# EAGLE design sym (EAGLE 6.6.0)
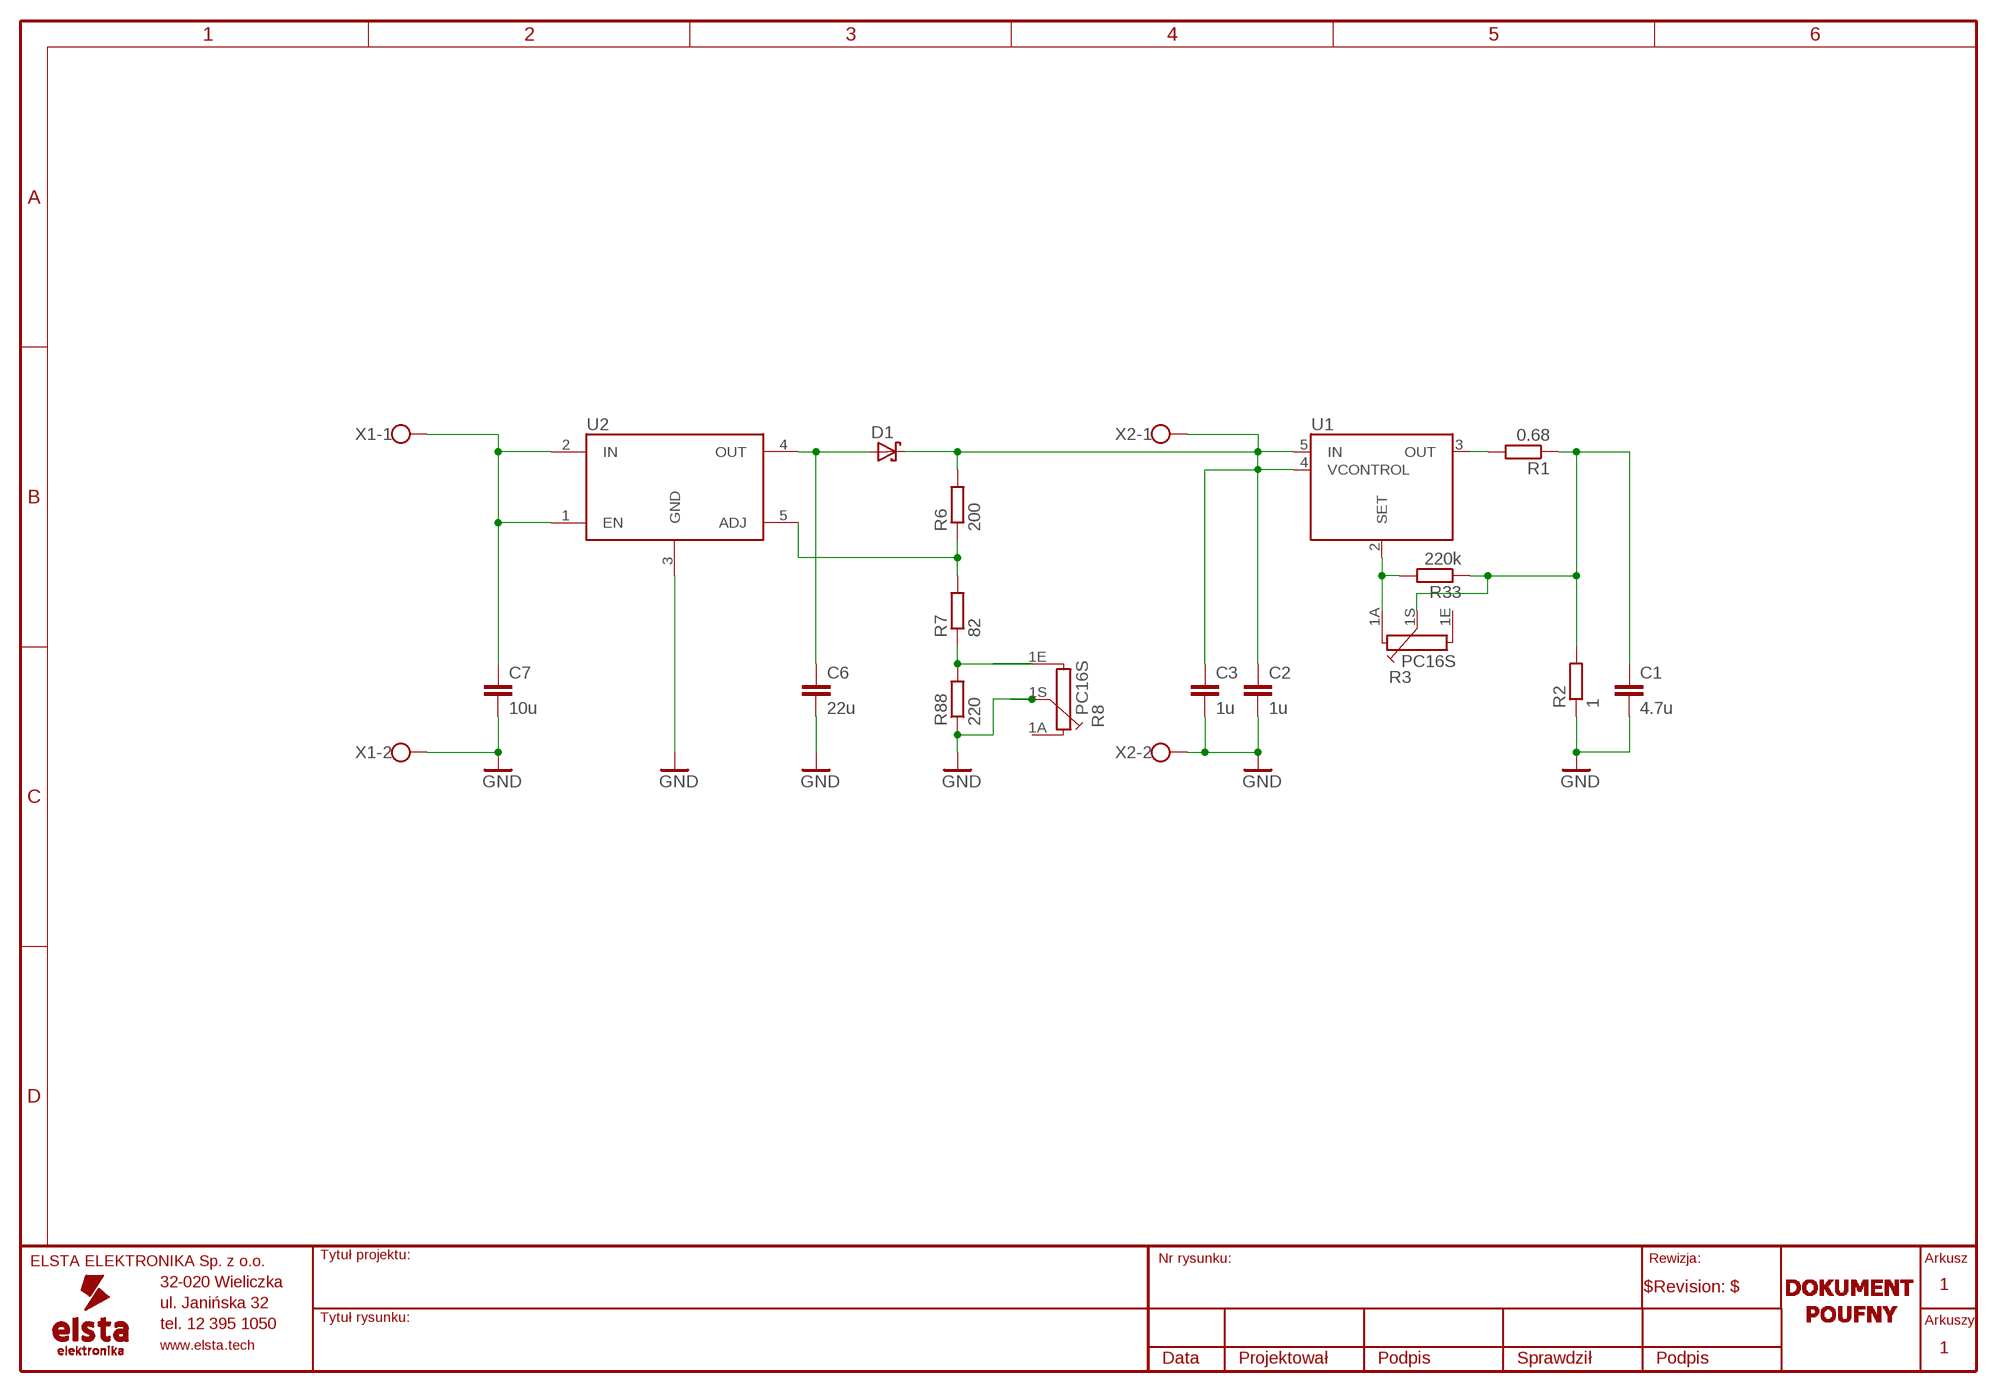
[diagram p0: schematic, sheet 1]

## Parts
C1  4.7u  C1206  [C1206]
C2  1u  C1206  [C1206]
C3  1u  C1206  [C1206]
C6  22u  C1206  [C1206]
C7  10u  C1206  [C1206]
D1  1N5821  [D0,6]
R1  0.68  R-EU_0617/17  [0617/17]
R2  1  R-EU_0617/17  [0617/17]
R3  PC16S  [PC16S]
R6  200  R1206  [R1206]
R7  82  R1206  [R1206]
R8  PC16S  [PC16S]
R33  220k  R1206  [R1206]
R88  220  R0805  [R0805]
U1  LT3080ET/IT  [TO-220-5]
U2  MIC29302WT  [TO-220-5]
X1  W237-02P  [W237-132]
X2  W237-02P  [W237-132]

## Nets
GND: C1.2 C2.2 C3.2 C6.2 C7.2 R2.1 R8.1S R88.1 U2.3(GND) X1.2 X2.2
N$1: R7.1 R8.1E R88.2
N$2: R3.1A R33.2 U1.2(SET)
N$3: C6.1 D1.A U2.4(OUT)
N$4: R6.1 R7.2 U2.5(ADJ)
N$5: R1.2 U1.3(OUT)
N$6: C1.1 R1.1 R2.2 R3.1S R33.1
N$7: C2.1 C3.1 D1.C R6.2 U1.4(VCONTROL) U1.5(IN) X2.1
N$8: C7.1 U2.1(EN) U2.2(IN) X1.1
Unconnected: R3.1E R8.1A

## Library data of the parts
C1-C3 C6 C7 = !ELSTA_kondensatory:C: Capacitor
D1 = !ELSTA_diody:1N5821: 1N5821 D0.6
R1 R2 = resistor:R-EU_: RESISTOR, European symbol
R3 R8 = piher:PC16S: POTENTIOMETER single carbon potentiometer, 16 mm, S3ROH; OC_FARNELL: 4452940; OC_NEWARK: unknown
R6 R7 R33 R88 = !ELSTA_rezystory:R: Resistors
U1 = !ELSTA_ic_moj:LT3080: 1.1A Voltage regulator
U2 = !ELSTA_ic_moj:MIC29302: 3A LDO Regulator
X1 X2 = !ELSTA_zlacza:W237-02P: WAGO SREW CLAMP

## Board
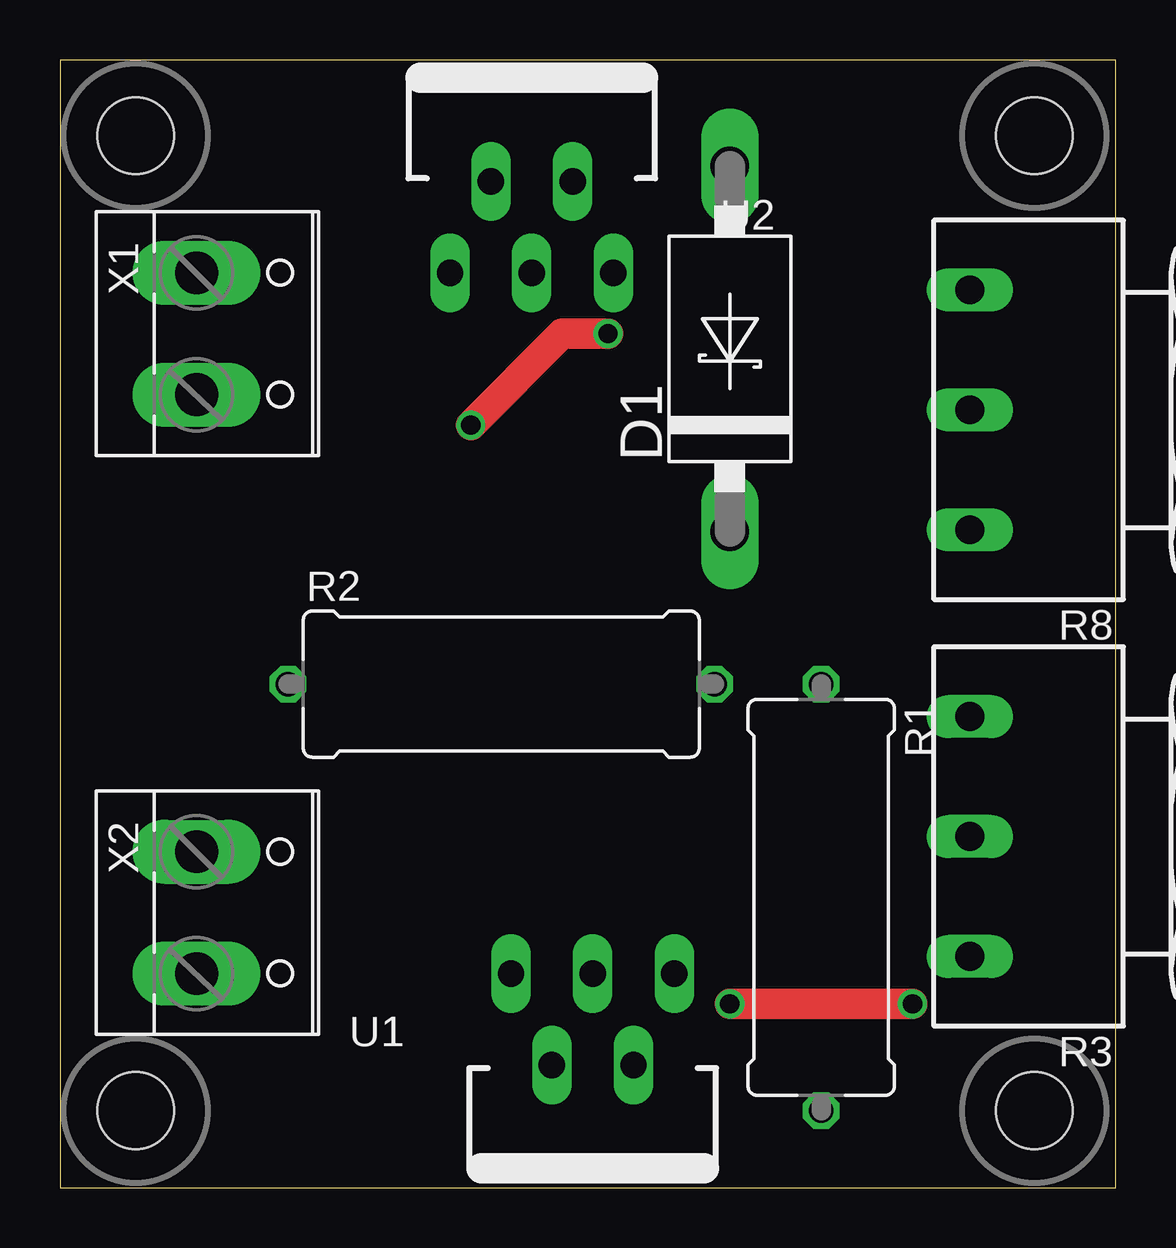
[diagram p1: board, top side]
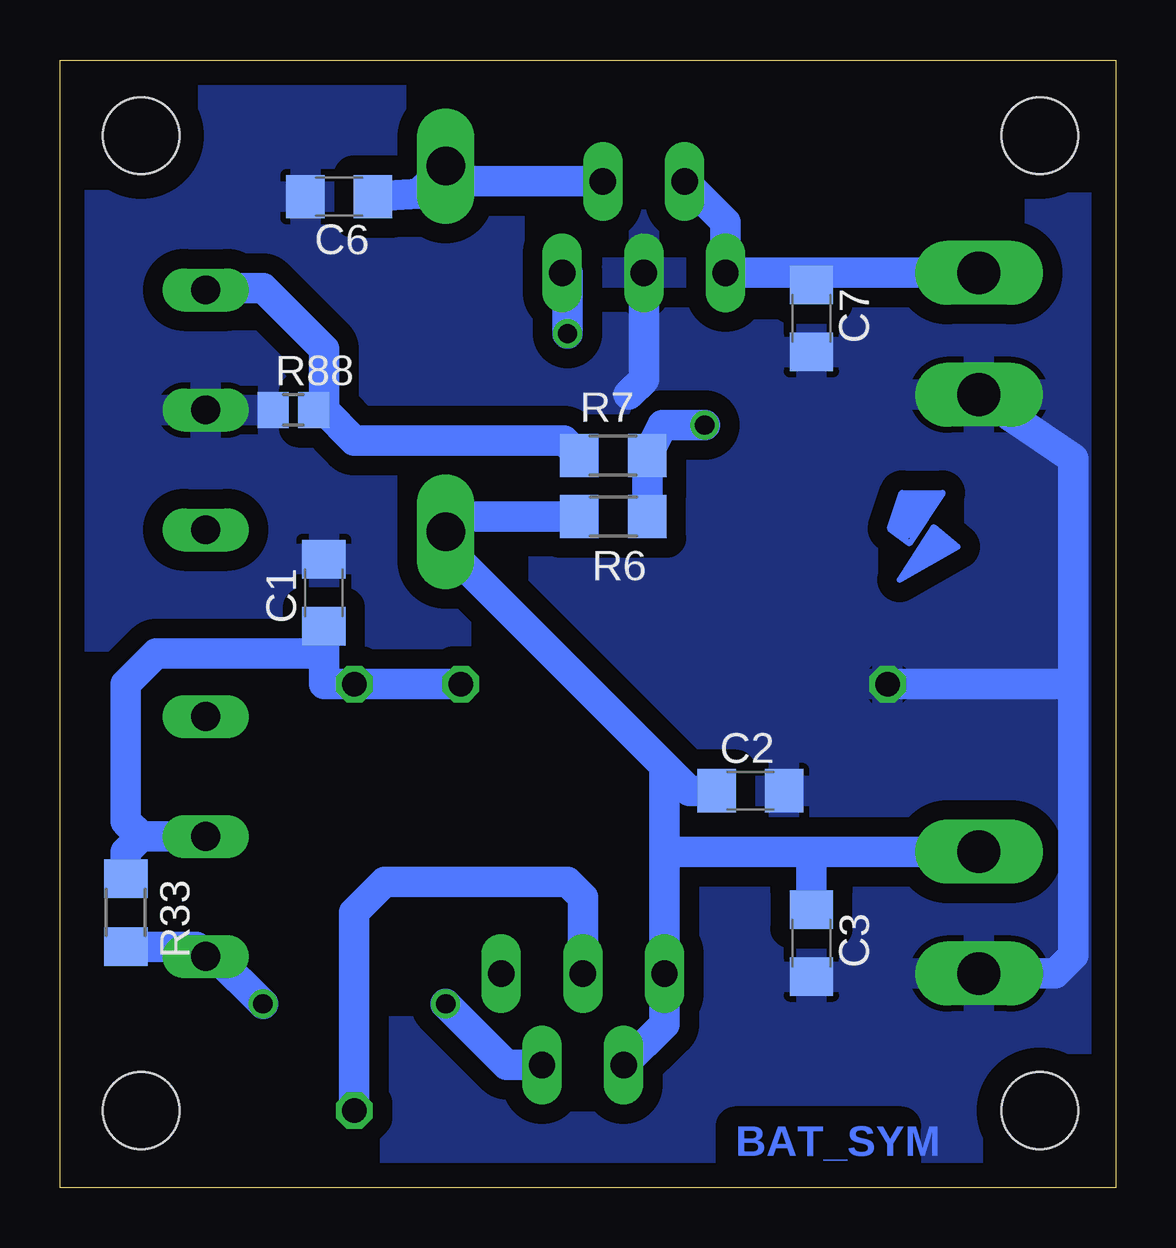
[diagram p2: board, bottom side, seen from below]

Size 44 x 47 mm. Coordinates in mm from the lower left corner, seen from the top.
Outline: 0,0 44,0 44,47 0,47 0,0
Copper layers (1*16): Top 0.035mm / dielectric 1.5mm / Bottom 0.035mm
Design rules "default": minimum track width 10mil, minimum drill 24mil, track to track 8mil, track to pad 8mil, pad to pad 8mil, via to via 8mil, smd to smd 8mil, copper to edge 40mil, drill to drill 8mil, minimum pad ring 10mil, minimum via ring 8mil, stop-mask expansion 4mil, vias tented up to drill 0mil, thermal gap 10mil
Holes 3.2 mm at 3.16,43.84 3.16,3.21 40.62,3.21 40.62,43.84

### Footprints (pad centres in the part's own frame; a part is rotated, then mirrored left to right if it is on the bottom)
C1206 = smd 1.6 x 1.8: 1 -1.4,0; 2 1.4,0
D0,6 = drill 1.6 long: A 7.62,0; C -7.62,0
0617/17 = drill 1.016 octagon: 1 -8.89,0; 2 8.89,0
PC16S = drill 1.2 long: 1A -5,6.5; 1E 5,6.5; 1S 0,6.5
R1206 = smd 1.6 x 1.803: 1 -1.422,0; 2 1.422,0
R0805 = smd 1.3 x 1.5: 1 -0.85,0; 2 0.85,0
TO-220-5 = drill 1.1 pad 1.422 long: 1 3.404,3.81; 2 1.702,0; 3 0,3.81; 4 -1.702,0; 5 -3.404,3.81
W237-132 = drill 1.778 long: 1 -2.54,-0.635; 2 2.54,-0.635

### Placement (x,y rotation side)
C1  33,24.8 90 bottom
C2  15.22,16.54 0 bottom
C3  12.68,10.19 270 bottom
C6  32.37,41.31 180 bottom
C7  12.68,36.23 270 bottom
D1  27.92,34.95 90 top
R1  31.73,12.1 270 top
R2  18.4,20.98 0 top
R3  44.43,14.64 90 top
R6  20.94,27.97 180 bottom
R7  20.94,30.51 0 bottom
R8  44.43,32.42 90 top
R33  41.25,11.46 270 bottom
R88  34.27,32.42 0 bottom
U1  22.2,5.11 0 top
U2  19.66,41.94 180 top
U$1  [A4_LANDSCAPE_2:1_TOP]  -13.99,-25.37 0 top  (outside the outline)
U$2  [EE_LOGO_LIGHTNING]  10.14,24.16 0 bottom
U$3  [A4_LANDSCAPE_2:1_BOTTOM]  -13.99,-25.37 0 top  (outside the outline)
X1  6.33,35.59 270 top
X2  6.33,11.46 270 top

### Tracks (layer width: path | path; a pad name or v marks a point on that pad's centre or on a via)
GND
  Bottom 1.27: 1.76,20.98 1.76,30.38 X1.2 | R2.1 1.76,20.98 | U2.3 19.66,33.69 20.3,33.05 | 1.76,20.98 1.76,9.69 2.52,8.92 X2.2
  pour Bottom (isolate 0.813): -0.02,0.03 44.43,0.03 44.43,47.02 -0.02,47.02
N$1
  Bottom 1.27: R7.1 22.99,31.14 31.73,31.14 33,32.42 | R8.1E 37.85,37.5 35.54,37.5 33,34.95 33,32.42 | R88.2 33,32.42
N$2  (via drill 0.8)
  Top 1.27: v35.54,7.65 v27.92,7.65
  Bottom 1.27: v27.92,7.65 25.38,5.11 U1.2 | v35.54,7.65 37.53,9.64 R3.1A 38.33,10.04 R33.2
N$3
  Bottom 1.27: C6.1 29.06,41.44 D1.A 27.28,41.94 U2.4
N$4  (via drill 0.8)
  Top 1.27: v22.84,35.59 20.94,35.59 v17.12,31.78
  Bottom 1.27: R6.1 R7.2 18.88,31.78 v17.12,31.78 | U2.5 22.84,38.13 v22.84,35.59
N$5
  Bottom 1.27: R1.2 31.73,11.46 30.46,12.73 22.84,12.73 22.2,12.1 U1.3
N$6
  Bottom 1.27: C1.1 33,22.26 | 33,22.26 33,20.98 R1.1 R2.2 | 40.62,14.64 41.25,15.27 41.25,20.98 39.98,22.26 33,22.26 | 40.62,14.64 R3.1S | R33.1 41.25,14 40.62,14.64
N$7
  Bottom 1.27: U1.4 18.8,6.81 U1.5 18.8,14 | 18.8,17.58 18.8,14 | 18.8,17.58 17.76,16.54 C2.1 | 18.8,17.58 27.92,26.7 D1.C 27.28,27.97 R6.2 | X2.1 12.68,14 | 12.68,14 18.8,14 | C3.1 12.68,14
N$8
  Bottom 1.27: U2.2 16.26,40.24 U2.1 12.68,38.13 | X1.1 12.68,38.13 | C7.1 12.68,38.13

### Text on the board
Bottom: BAT_SYM